# EAGLE design senseBox-BME680_v20 (EAGLE 7.7.0)
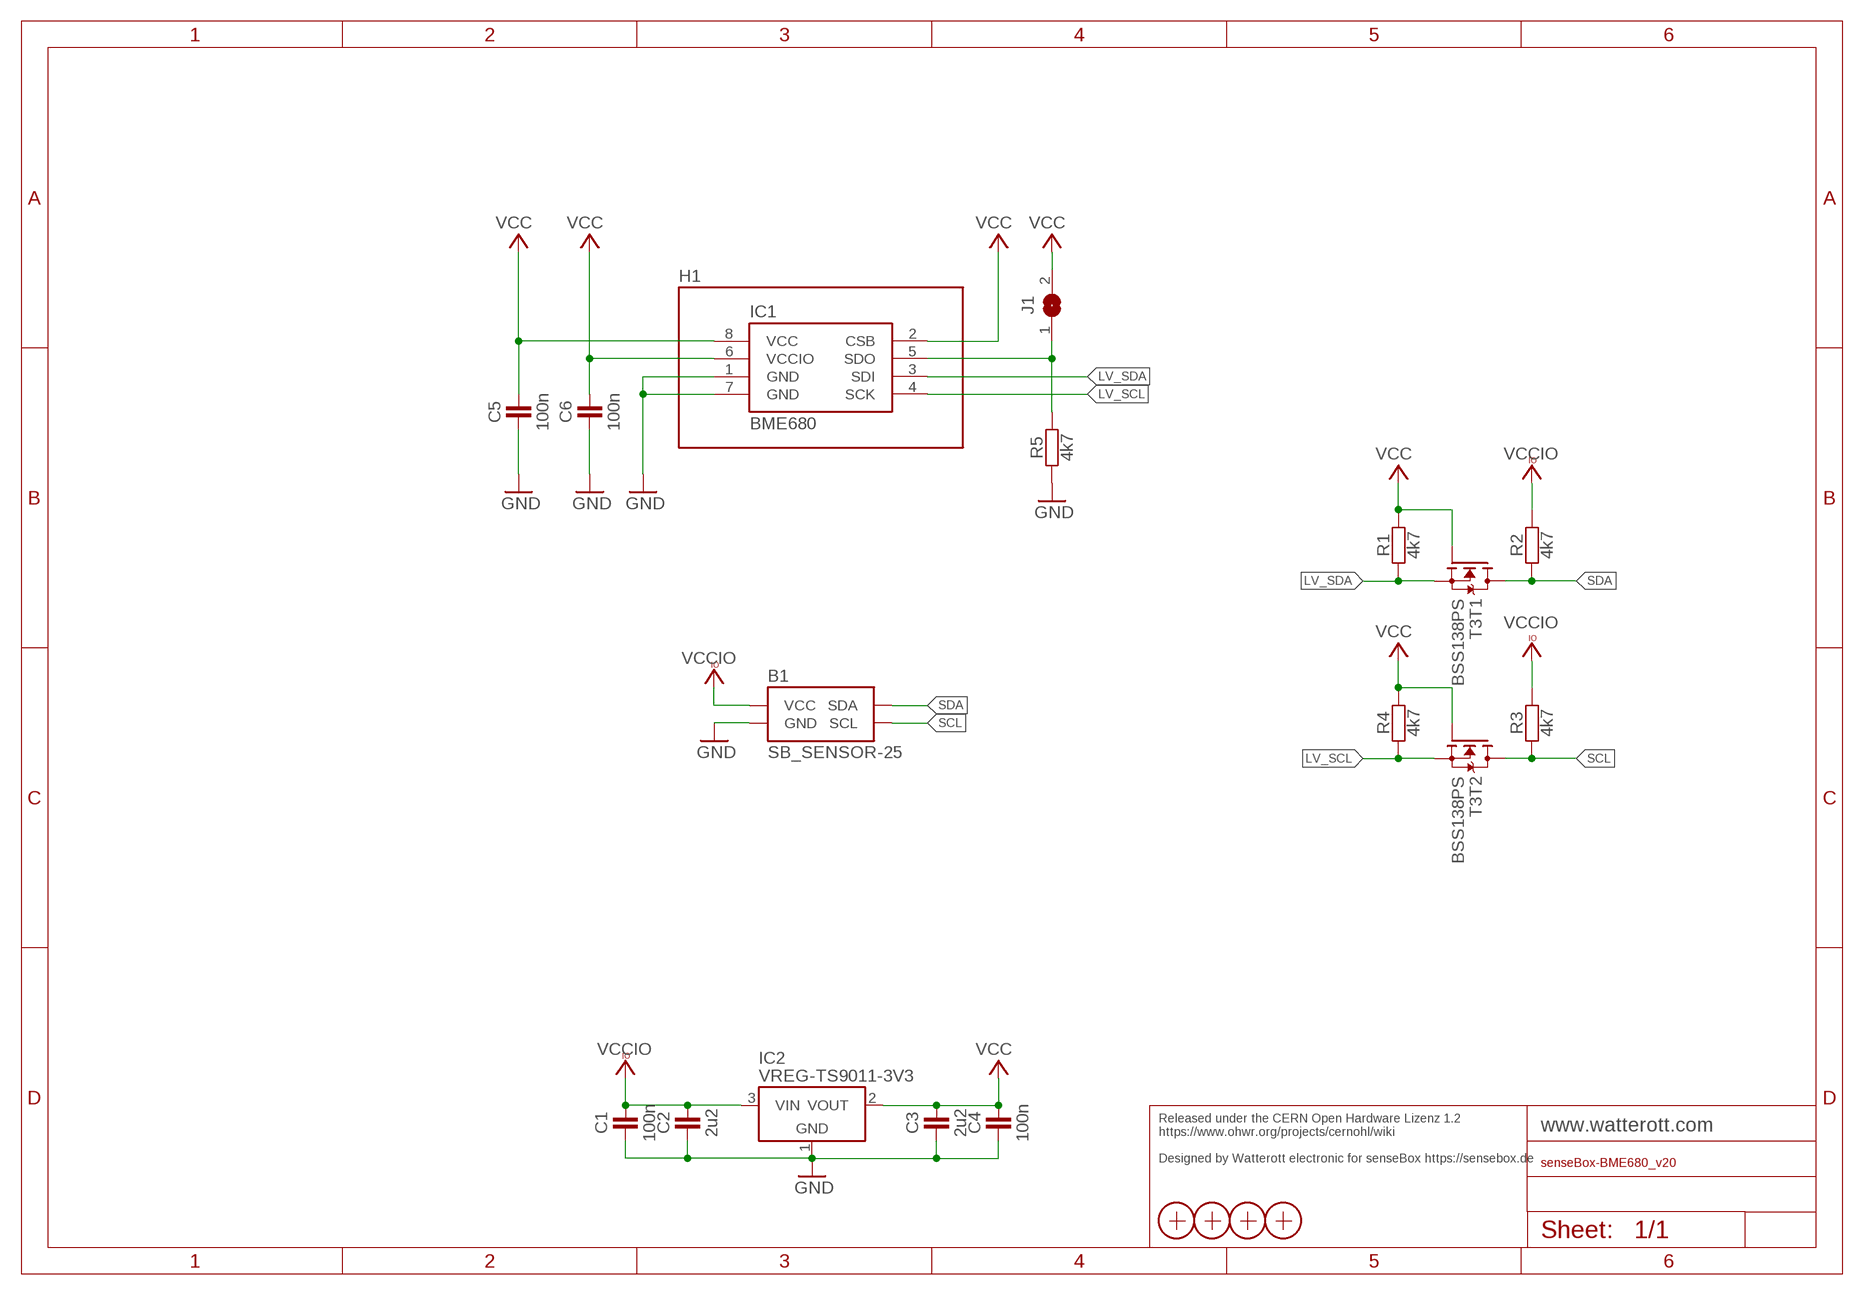
[diagram p0: schematic, sheet 1]

## Parts
B1  SB_SENSOR-25  [SB-25X25]
C1  100n  CAPACITOR-0402  [C0402]
C2  2u2  CAPACITOR-0402  [C0402]
C3  2u2  CAPACITOR-0402  [C0402]
C4  100n  CAPACITOR-0402  [C0402]
C5  100n  CAPACITOR-0402  [C0402]
C6  100n  CAPACITOR-0402  [C0402]
H1  SF2  [SF2]
IC1  BME680  [BME680]
IC2  VREG-TS9011-3V3  [SOT23]
J1  JUMPER2-0402-NC  [JUMPER2-0402_NC]
R1  4k7  RESISTOR-0402  [C0402]
R2  4k7  RESISTOR-0402  [C0402]
R3  4k7  RESISTOR-0402  [C0402]
R4  4k7  RESISTOR-0402  [C0402]
R5  4k7  RESISTOR-0402  [C0402]
T3  BSS138PS  [SOT363]
X1  PASSER-07  [PASSER_07MM]
X2  PASSER-07  [PASSER_07MM]
X3  PASSER-07  [PASSER_07MM]
X4  PASSER-07  [PASSER_07MM]

## Nets
GND: B1.GND C1.1 C2.1 C3.1 C4.1 C5.1 C6.1 IC1.1(GND) IC1.7(GND) IC2.1(GND) R5.1
LV_SCL: IC1.4(SCK) R4.1 T3.4(T2:S)
LV_SDA: IC1.3(SDI) R1.1 T3.1(T1:S)
LV_SDO: IC1.5(SDO) J1.1 R5.2
SCL: B1.SCL R3.1 T3.3(T2:D)
SDA: B1.SDA R2.1 T3.6(T1:D)
VCC: C3.2 C4.2 C5.2 C6.2 IC1.2(CSB) IC1.6(VCCIO) IC1.8(VCC) IC2.2(VOUT) J1.2 R1.2 R4.2 T3.2(T1:G) T3.5(T2:G)
VCCIO: B1.VCC C1.2 C2.2 IC2.3(VIN) R2.2 R3.2

## Notes on the sheet
- Released under the CERN Open Hardware Lizenz 1.2
  https://www.ohwr.org/projects/cernohl/wiki
  
  Designed by Watterott electronic for senseBox https://sensebox.de

## Library data of the parts
B1 = we-board:SB_SENSOR: SenseBox Sensors/Breakouts
C1-C6 = we-rcl:CAPACITOR: Capacitors ...2.2uF @ 6.3V -> 0402 ...4.7uF @ 6.3V -> 0603 ...10uF @ 16V -> 0805 ...22uF @ 25V -> 1206
H1 = we-sensor:SF2: Sensirion SF2 Filter Cab/Housing for Humidity Sensors
IC1 = we-sensor:BME680: Bosch BME280 Humidity, Pressure, Air Quality Sensor
IC2 = we-power:VREG: Voltage Regulators (LDOs, Switching Converters...) LDOs Taiwan Semi TS1117 800mA max 15V - compatible On Semi NCP1117 1A max 20V - compatible Diodes AP2111H 0.6A max 6V (0.25V@0.6A) - compatible Diodes AP2114H 1A max 6V (0.45V@1A) Taiwan Semi TS9011 250mA max 12V - compatible Diodes AP2210 300mA max 15V - compatible Microchip MCP1700 250mA max 6.5V - compatible Microchip MCP1702 250mA max 13V - compatible Microchip MCP1703 250mA max 16V - compatible Microchip MCP1754 150mA max 16V Taiwan Semi TS5204 80mA max 16V (low noise) DC/DC Converter Modules Recom R-78Ex.x-1.0-W36 1A max 28V - compatible CUI V78xx-2000 2A max 18V Murata OKI-78SR-x.x/1.5-W36 1.5A max 36V
J1 = we-rcl:JUMPER2: 2 Pin Jumpers
R1-R5 = we-rcl:RESISTOR: Resistors all kinds in 0402 and 0603
T3 = we-transistor:BSS138PS: Dual N-Channel MOSFET BSS138 (Vgs>=+/-20V, Vds>=40V, Id>=0.2A + Rds<=3Ohm @ Vgs=4.5V)
X1-X4 = we-symbol:PASSER: Fiducial Markers

## Board
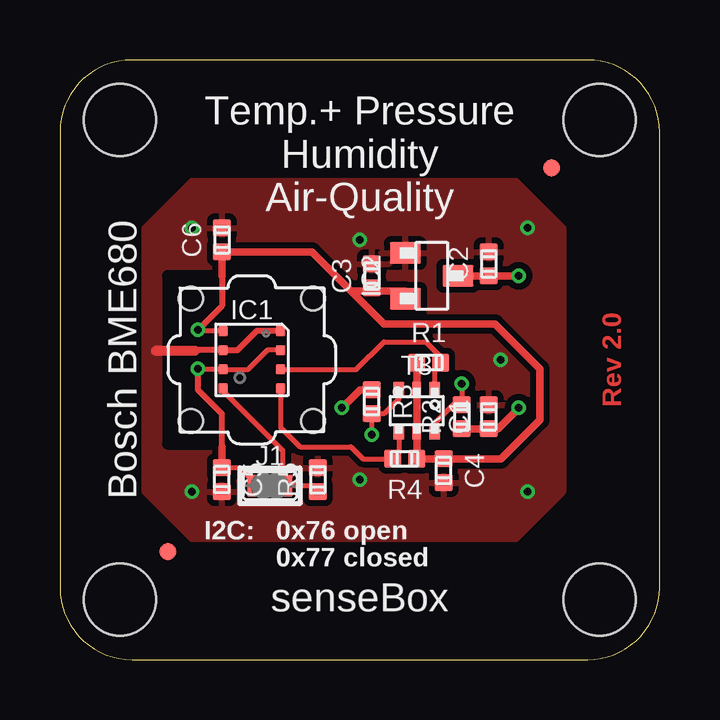
[diagram p1: board, top side]
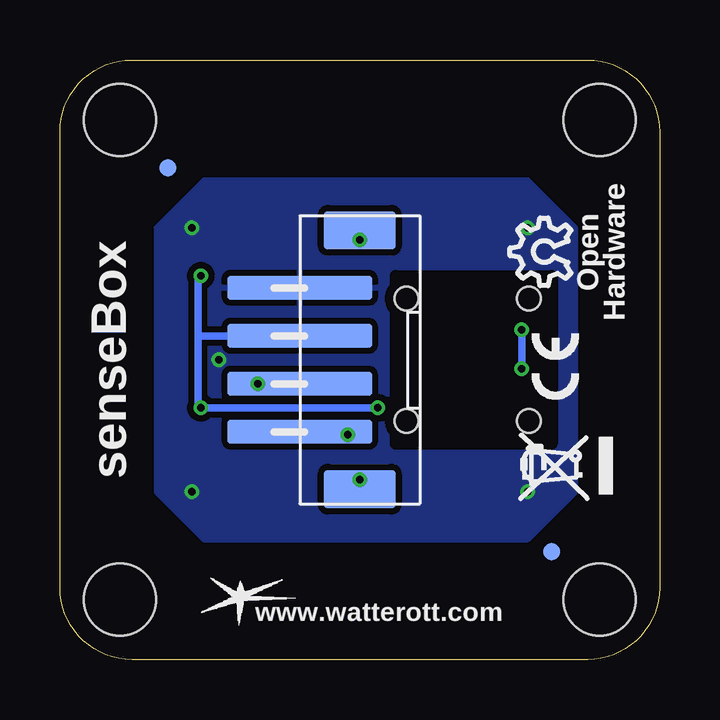
[diagram p2: board, bottom side, seen from below]

Size 25 x 25 mm. Coordinates in mm from the lower left corner, seen from the top.
Copper layers (1*16): Top 0.035mm / dielectric 1.5mm / Bottom 0.035mm
Design rules "we-dru-2-layer": minimum track width 0.15mm, minimum drill 0.3mm, track to track 0.15mm, track to pad 0.15mm, pad to pad 0.15mm, via to via 0.15mm, smd to smd 0.1mm, copper to edge 0.4mm, drill to drill 0.2mm, minimum pad ring 0.18mm, minimum via ring 0.16mm, stop-mask expansion 0.1mm, vias tented up to drill 0.5mm, thermal gap 0.25mm
tRestrict: area 4.5,9 to 11,16
bRestrict: area 4.5,9 to 11,16

### Footprints (pad centres in the part's own frame; a part is rotated, then mirrored left to right if it is on the bottom)
SB-25X25 = smd 6 x 1 bottom: GND 15,15.5; SCL 15,9.5; SDA 15,11.5; VCC 15,13.5 | smd 3 x 1.6 bottom: SHLD1 12.5,17.9; SHLD2 12.5,7.1 | hole 3: 2.5,22.5; 2.5,2.5; 22.5,22.5; 22.5,2.5
C0402 = smd 0.75 x 0.7: 1 0,0.5; 2 0,-0.5
SF2 = hole 1: -2.55,-2.55; 2.55,-2.55; 2.55,2.55; -2.55,2.55
BME680 = smd 0.4 x 0.4: 1 1.2,1.2; 2 1.2,0.4; 3 1.2,-0.4; 4 1.2,-1.2; 5 -1.2,-1.2; 6 -1.2,-0.4; 7 -1.2,0.4; 8 -1.2,1.2
SOT23 = smd 1.3 x 0.9: 1 -1.1,0.95; 2 -1.1,-0.95; 3 1.1,0
JUMPER2-0402_NC = smd 0.9 x 0.8: 1 0,0.55; 2 0,-0.55
SOT363 = smd 0.6 x 0.5: 1 -0.9,0.75; 3 -0.9,-0.75; 4 0.9,-0.75; 6 0.9,0.75 | smd 0.6 x 0.4: 2 -0.9,0; 5 0.9,0
PASSER_07MM = smd 0.7 x 0.7: X 0,0

### Placement (x,y rotation side)
B1  0,0 0 top
C1  17.88,10.12 0 top
C2  17.88,16.5 0 top
C3  13,16 0 top
C4  16,7.88 180 top
C5  6.75,7.5 180 top
C6  6.75,17.5 0 top
H1  8,12.5 0 top
IC1  8,12.5 0 top
IC2  15.5,16 0 top
J1  8.75,7.25 270 top
R1  15.38,12.38 270 top
R2  16.75,10.12 0 top
R3  13,10.75 180 top
R4  14.38,8.38 90 top
R5  10.75,7.5 0 top
T3  14.88,10.38 270 top
X1  20.5,20.5 0 top
X2  4.5,4.5 0 top
X3  4.5,4.5 0 bottom
X4  20.5,20.5 0 bottom

### Tracks (layer width: path | path; a pad name or v marks a point on that pad's centre or on a via)
GND  (via drill 0.3)
  Top 0.254: IC1.1 8.2,13.7 7.4,12.9 IC1.7 5.62,12.9 5.62,12.88
  Top 0.406: 5.62,12.88 4,12.88
  other vias: 19.5,18 5.5,18 5.5,7 19.5,7 18.38,12.5 12.5,7.5 12.5,17.5
  pour Top (isolate 0.254): 3.5,18 5.5,20 19,20 21,18 21,7 19,5 5.5,5 3.5,7
  pour Bottom (isolate 0.254): 3.5,18 5.5,20 19,20 21,18 21,7 19,5 5.5,5 3.5,7
LV_SCL
  Top 0.203: T3.4 14.12,8.62 R4.1 12.62,8.38 12.12,8.88 10,8.88 9.2,9.68 IC1.4
LV_SDA
  Top 0.203: T3.1 15.62,12.12 R1.1 15.88,12.62 15.25,13.25 13.5,13.25 12.35,12.1 IC1.3
LV_SDO
  Top 0.203: R5.2 10.75,7.25 J1.1 9.3,8.7 6.8,11.2 IC1.5
SCL  (via drill 0.3)
  Top 0.203: T3.3 14.12,10.88 13.5,10.25 R3.1 v13,9.38
  Bottom 0.203: B1.SCL 13,9.5 v13,9.38
SDA  (via drill 0.3)
  Top 0.203: T3.6 15.62,9.88 16.38,10.62 R2.1 v16.75,11.5
  Bottom 0.203: B1.SDA v16.75,11.5
VCC  (via drill 0.3)
  Top 0.203: IC2.2 14.4,15.03 14.38,15 | IC1.2 8.65,12.9 7.85,12.1 IC1.6 5.78,12.1 v5.75,12.12 | J1.2 8.12,7.25 8.12,7.38 7.5,8 C5.2 | IC1.8 5.8,13.7 v5.75,13.75
  Top 0.254: 6.75,8.88 6.75,10.25 5.75,11.25 v5.75,12.12 | 6.75,16 6.75,14.75 v5.75,13.75
  Top 0.305: 12.12,15.38 13.5,14 18.12,14 20,12.12 20,10 18.38,8.38 C4.2 R4.2 T3.5 T3.2 R1.2 | 12.12,15.38 10.5,17 C6.2 6.75,16 | 6.75,8.88 C5.2 | 14.38,15 14.38,15.38 13.12,15.38 | 13.12,15.38 C3.2 | 13.12,15.38 12.12,15.38
  Bottom 0.305: v5.75,13.75 v5.75,12.12
VCCIO  (via drill 0.3)
  Top 0.203: 18.25,9.62 C1.2
  Top 0.305: v19.12,16 C2.2 IC2.3 | v19.12,10.5 18.25,9.62 | C1.2 R2.2 | R3.2 12.5,11.25 v11.75,10.5
  Bottom 0.305: B1.VCC 19.25,13.5 | 19.25,13.5 19.25,15.88 v19.12,16 | 19.25,13.5 19.25,10.62 v19.12,10.5 v11.75,10.5

### Text on the board
Top: Rev 2.0
tPlace: Temp.+ Pressure / Humidity / Air-Quality | Bosch BME680 | I2C: | 0x76 open | 0x77 closed | senseBox
Reference: 21 tPlace + 22 bPlace